# EAGLE design Switch (EAGLE 6.5.0)
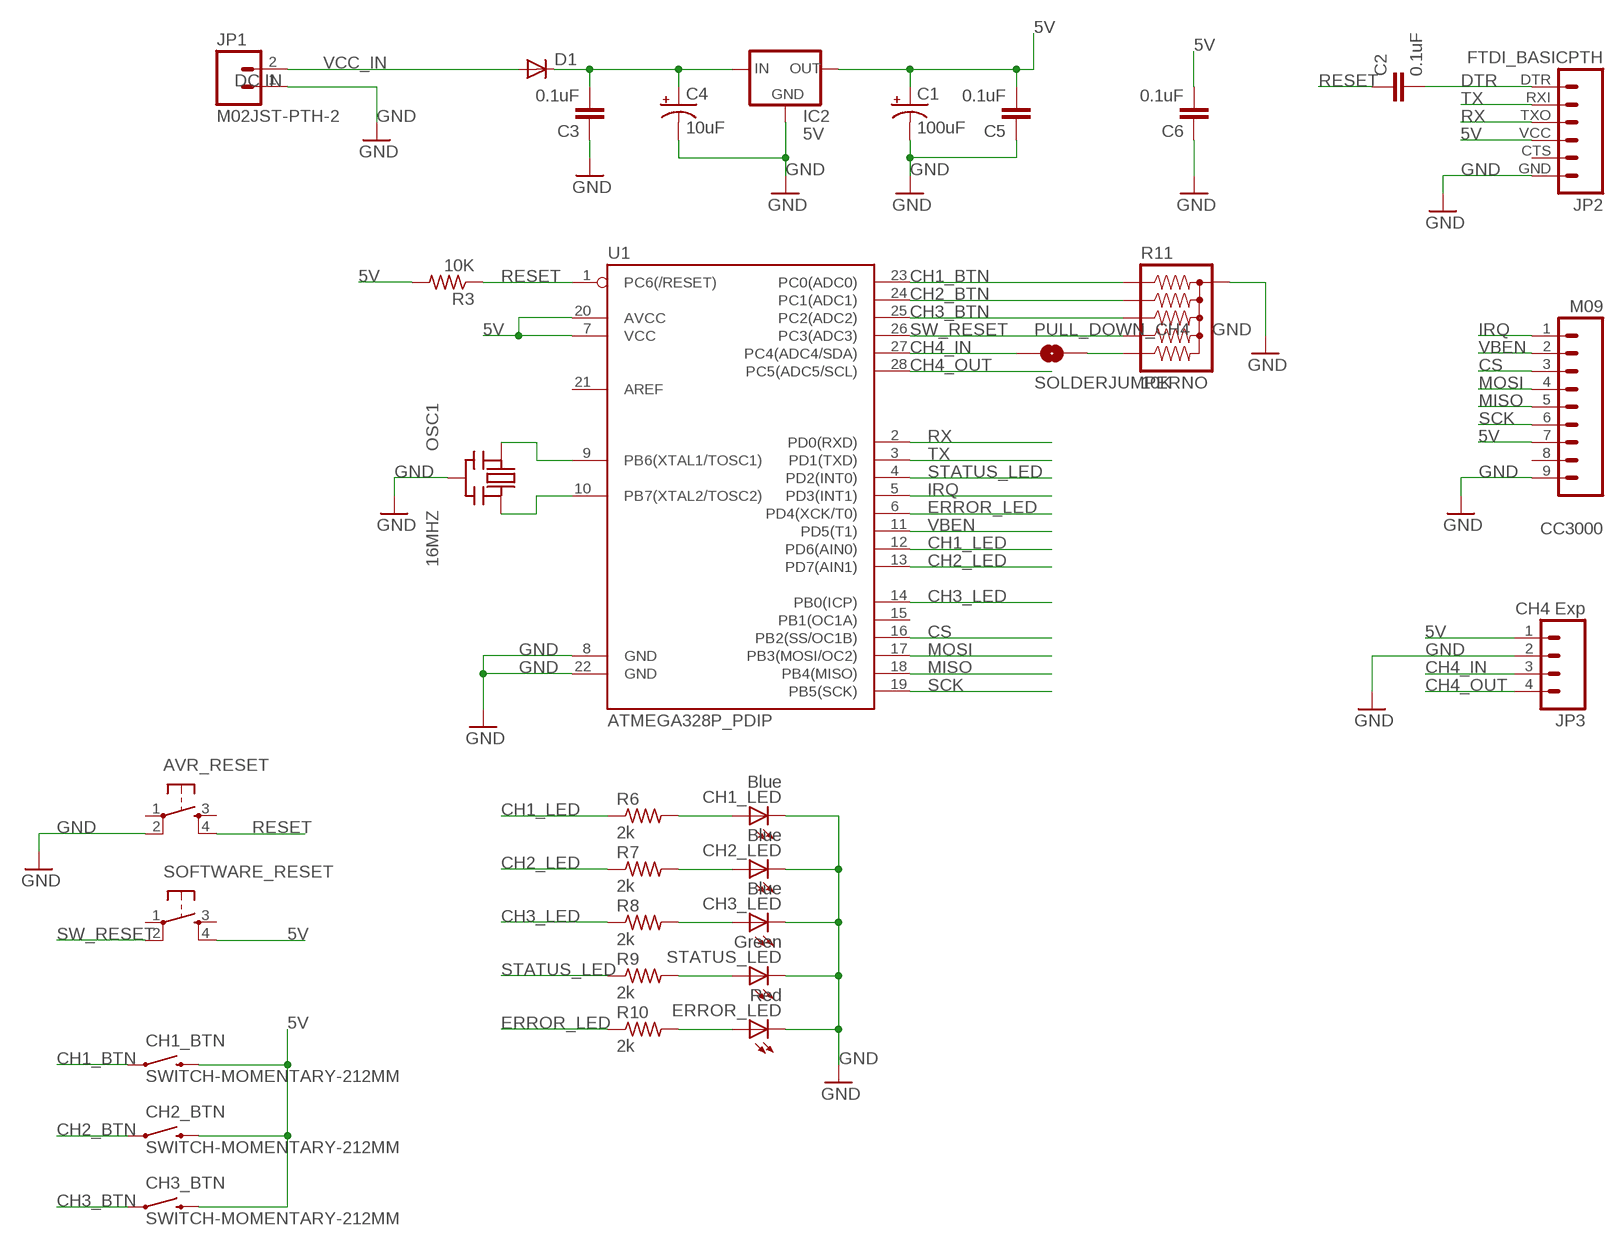
[diagram p0: schematic, sheet 1]

## Parts
AVR_RESET  TAC_SWITCHPTH  [TACTILE-PTH]
C1  100uF  CAP_POLPTH1  [CPOL-RADIAL-100UF-25V]
C2  0.1uF  CAPPTH  [CAP-PTH-SMALL]
C3  0.1uF  CAPPTH  [CAP-PTH-SMALL]
C4  10uF  CAP_POLPTH2  [CPOL-RADIAL-10UF-25V]
C5  0.1uF  CAPPTH  [CAP-PTH-SMALL]
C6  0.1uF  CAPPTH  [CAP-PTH-SMALL]
CC3000  M09  [1X09]
CH1_BTN  SWITCH-MOMENTARY-212MM  [TACTILE-PTH-12MM]
CH1_LED  Blue  LED3MM  [LED3MM]
CH2_BTN  SWITCH-MOMENTARY-212MM  [TACTILE-PTH-12MM]
CH2_LED  Blue  LED3MM  [LED3MM]
CH3_BTN  SWITCH-MOMENTARY-212MM  [TACTILE-PTH-12MM]
CH3_LED  Blue  LED3MM  [LED3MM]
D1  DIODEPTH  [DIODE-1N4001]
ERROR_LED  Red  LED3MM  [LED3MM]
IC2  5V  78XXS  [78XXS]
JP1  M02JST-PTH-2  [JST-2-PTH]
JP2  FTDI_BASICPTH  [FTDI_BASIC]
JP3  CH4 Exp  M04JST-PTH  [JST-4-PTH]
OSC1  16MHZ  CERMOSCILL-THM  [CERM_OSC]
PULL_DOWN_CH4  SOLDERJUMPERNO  [SJ_2S-NO]
R3  10K  R-US_0207/15  [0207/15]
R6  2k  R-US_0207/15  [0207/15]
R7  2k  R-US_0207/15  [0207/15]
R8  2k  R-US_0207/15  [0207/15]
R9  2k  R-US_0207/15  [0207/15]
R10  2k  R-US_0207/15  [0207/15]
R11  10K  RPACK-BUSSED-SIP-PTH-5  [RPACK-SIP-PTH-5]
SOFTWARE_RESET  TAC_SWITCHPTH  [TACTILE-PTH]
STATUS_LED  Green  LED3MM  [LED3MM]
U1  ATMEGA328P_PDIP  [DIL28-3]

## Nets
5V: C1.1(+) C5.2 C6.2 CC3000.7 CH1_BTN.3 CH2_BTN.3 CH3_BTN.3 IC2.OUT JP2.VCC JP3.1 R3.2 SOFTWARE_RESET.4 U1.7(VCC) U1.20(AVCC)
CH1_BTN: CH1_BTN.1 R11.P$2 U1.23(PC0(ADC0))
CH1_LED: R6.1 U1.12(PD6(AIN0))
CH2_BTN: CH2_BTN.1 R11.P$3 U1.24(PC1(ADC1))
CH2_LED: R7.1 U1.13(PD7(AIN1))
CH3_BTN: CH3_BTN.1 R11.P$4 U1.25(PC2(ADC2))
CH3_LED: R8.1 U1.14(PB0(ICP))
CH4_IN: JP3.3 PULL_DOWN_CH4.1 U1.27(PC4(ADC4/SDA))
CH4_OUT: JP3.4 U1.28(PC5(ADC5/SCL))
CS: CC3000.3 U1.16(PB2(SS/OC1B))
DTR: C2.2 JP2.DTR
ERROR_LED: R10.1 U1.6(PD4(XCK/T0))
GND: AVR_RESET.2 C1.2(-) C3.1 C4.2(-) C5.1 C6.1 CC3000.9 CH1_LED.K(C) CH2_LED.K(C) CH3_LED.K(C) ERROR_LED.K(C) IC2.GND JP1.1 JP2.GND JP3.2 OSC1.P$2(GND) R11.P$1 STATUS_LED.K(C) U1.8(GND) U1.22(GND)
IRQ: CC3000.1 U1.5(PD3(INT1))
MISO: CC3000.5 U1.18(PB4(MISO))
MOSI: CC3000.4 U1.17(PB3(MOSI/OC2))
N$1: ERROR_LED.A R10.2
N$2: R9.2 STATUS_LED.A
N$3: CH3_LED.A R8.2
N$4: CH2_LED.A R7.2
N$5: CH1_LED.A R6.2
N$6: OSC1.P$1(IN) U1.9(PB6(XTAL1/TOSC1))
N$7: OSC1.P$3(OUT) U1.10(PB7(XTAL2/TOSC2))
N$8: PULL_DOWN_CH4.2 R11.P$6
N$10: C3.2 C4.1(+) D1.C IC2.IN
RESET: AVR_RESET.4 C2.1 R3.1 U1.1(PC6(/RESET))
RX: JP2.TXO U1.2(PD0(RXD))
SCK: CC3000.6 U1.19(PB5(SCK))
STATUS_LED: R9.1 U1.4(PD2(INT0))
SW_RESET: R11.P$5 SOFTWARE_RESET.2 U1.26(PC3(ADC3))
TX: JP2.RXI U1.3(PD1(TXD))
VBEN: CC3000.2 U1.11(PD5(T1))
VCC_IN: D1.A JP1.2
Unconnected: AVR_RESET.1 AVR_RESET.3 CC3000.8 JP2.CTS SOFTWARE_RESET.1 SOFTWARE_RESET.3 U1.15(PB1(OC1A)) U1.21(AREF)

## Library data of the parts
AVR_RESET SOFTWARE_RESET = SparkFun-Electromechanical:TAC_SWITCH: Momentary Switch Button commonly used for reset or general input. Spark Fun Electronics SKU : COM-00097 SMT- SWCH-08247
C1 C4 = SparkFun-Passives:CAP_POL: Capacitor Polarized These are standard SMD and PTH capacitors. Normally 10uF, 47uF, and 100uF in electrolytic and tantalum varieties. Always verify the external diameter of the through hole cap, it varies with capacity, voltage, and manufacturer. The EIA devices should be standard.
C2 C3 C5 C6 = SparkFun-Passives:CAP: Capacitor Standard 0603 ceramic capacitor, and 0.1" leaded capacitor.
CC3000 = SparkFun-Connectors:M09: Header 9 Standard 9-pin 0.1" header. Use with straight break away headers (SKU : PRT-00116), right angle break away headers (PRT-00553), swiss pins (PRT-00743), machine pins (PRT-00117), and female headers (PRT-00115).
CH1_BTN CH2_BTN CH3_BTN = SparkFun-Electromechanical:SWITCH-MOMENTARY-2: Various NO switches- pushbuttons, reed, etc; PROD_ID: SWCH-09185
CH1_LED CH2_LED CH3_LED ERROR_LED STATUS_LED = SparkFun-LED:LED: LEDs Standard schematic elements and footprints for 5mm, 3mm, 1206, and 0603 sized LEDs. 5mm - Spark Fun Electronics SKU : COM-00529 (and others)
D1 = SparkFun-DiscreteSemi:DIODE: Diode These are standard reverse protection diodes and small signal diodes. SMA package can handle up to about 1A. SOD-323 can handle about 200mA. What the SOD-323 package when ordering, there are some mfgs out there that are 5-pin packages.
IC2 = v-reg:78XXS: VOLTAGE REGULATOR
JP1 = SparkFun-Connectors:M02: Standard 2-pin 0.1" header. Use with - straight break away headers ( PRT-00116) - right angle break away headers (PRT-00553) - swiss pins (PRT-00743) - machine pins (PRT-00117) - female headers (PRT-00115) Molex polarized connector foot print use with: PRT-08233 with associated crimp pins and housings. 2.54_SCREWTERM for use with PRT-10571. 3.5mm Screw Terminal footprints for PRT-08084 5mm Screw Terminal footprints for use with PRT-08433; LABEL: DC IN; SKU: PRT-09914
JP2 = SparkFun-Connectors:FTDI_BASIC: FTDI Basic header with labels
JP3 = SparkFun-Connectors:M04: Header 4 Standard 4-pin 0.1" header. Use with straight break away headers (SKU : PRT-00116), right angle break away headers (PRT-00553), swiss pins (PRT-00743), machine pins (PRT-00117), and female headers (PRT-00115). Molex polarized connector foot print use with SKU : PRT-08231 with associated crimp pins and housings. 1MM SMD Version SKU: PRT-10208; SKU: PRT-09916
OSC1 = adafruit:CERMOSCILL: Ceramic oscillator with built in capacitors such as ZTT-12MHz http://www.ladyada.net/library/eagle
PULL_DOWN_CH4 = SparkFun-Passives:SOLDERJUMPER: Solder Jumper Standard SMD solder jumper. Used to automate production. Two varients : Normally Open and Normally Closed are the same, but have different paste layers. NC will have a large amount of paste and should jumper during reflow.
R3 R6-R10 = resistor:R-US_: RESISTOR, American symbol
R11 = SparkFun-Passives:RPACK*: BOURNS 4600X series thick-film SIP resistor packs Five resistors bussed to a single pin (denoted by dot). 0.2W / resistor datasheet <http://dlnmh9ip6v2uc.cloudfront.net/datasheets/Components/General/4600x.pdf> SFE parts COM-10855 (330), COM-10856 (10K)
U1 = SparkFun-DigitalIC:ATMEGA328P_PDIP: uC used in the Arduino 32kb flash, 1k EEPROM, 2k SRAM This is the through-hole version of this chip.

## Board
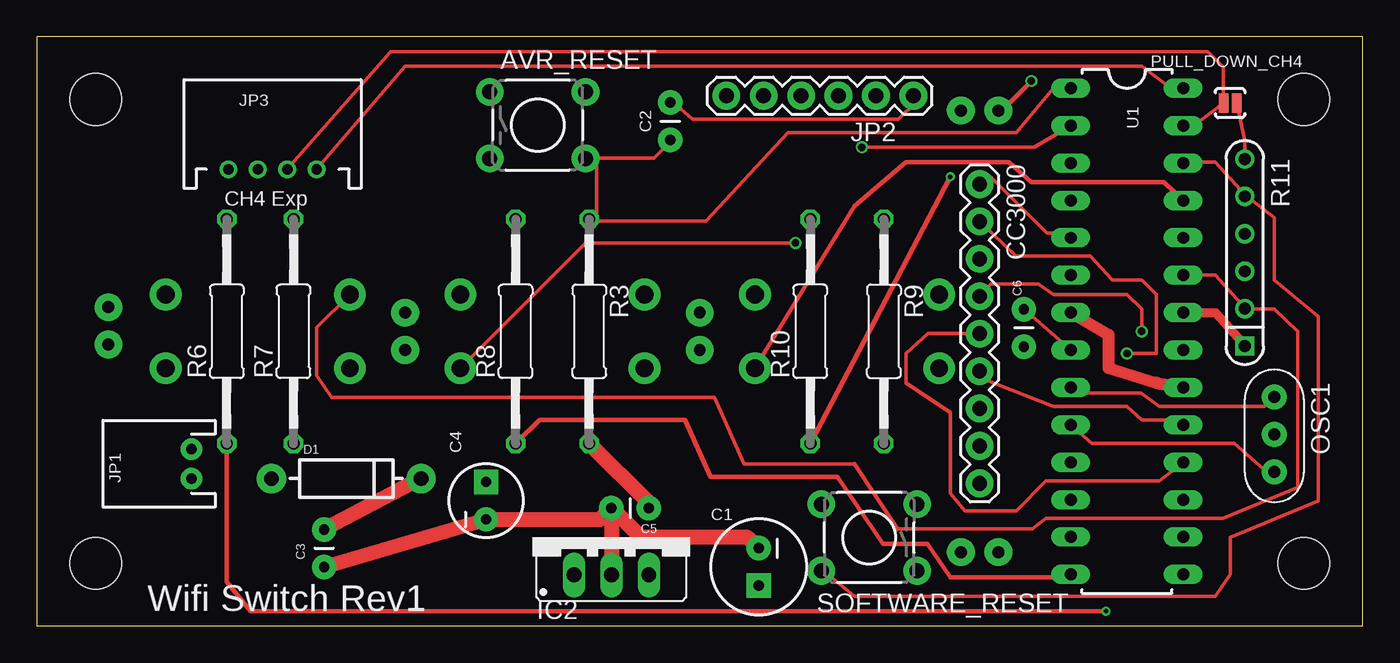
[diagram p1: board, top side]
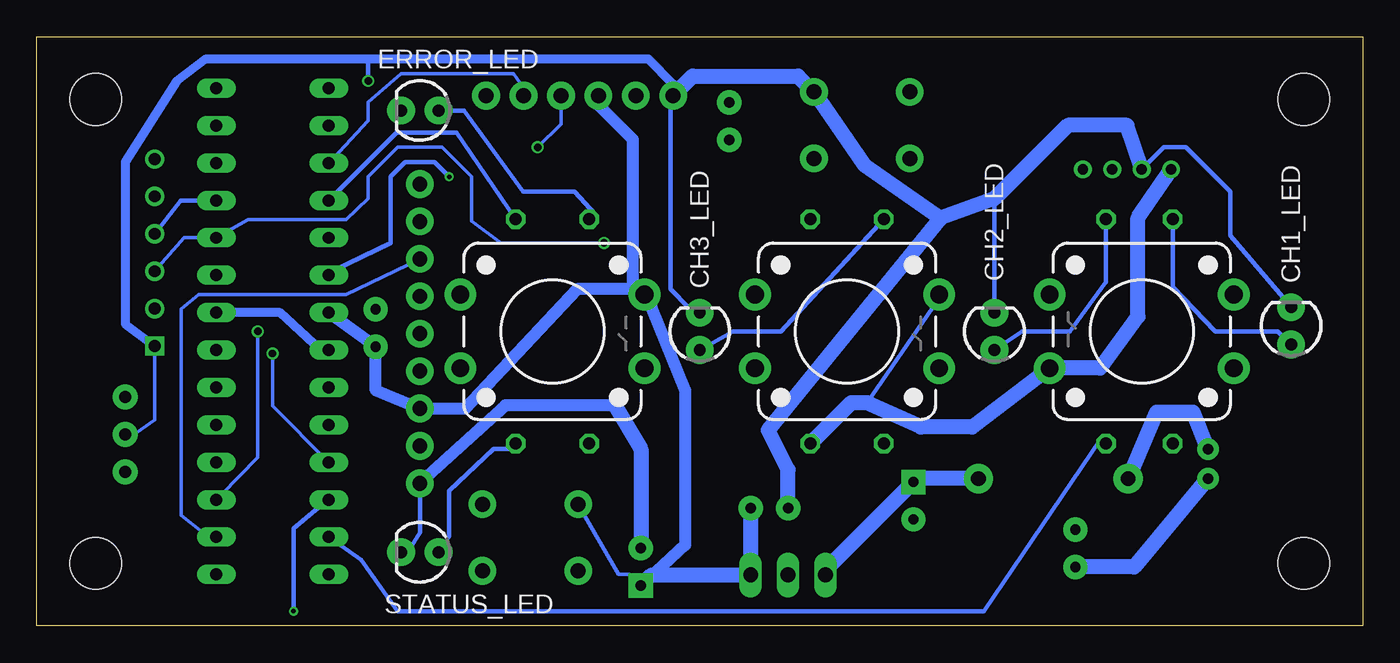
[diagram p2: board, bottom side, seen from below]

Size 90 x 40 mm. Coordinates in mm from the lower left corner, seen from the top.
Outline: 0,0 90,0 90,40 0,40 0,0
Copper layers (1*16): Top 0.035mm / dielectric 1.5mm / Bottom 0.035mm
Design rules "SeeedStudio_2layer_DRU_no_angle_20140221": minimum track width 6mil, minimum drill 12mil, track to track 6mil, track to pad 6mil, pad to pad 6mil, via to via 6mil, smd to smd 0mil, copper to edge 10mil, drill to drill 10mil, minimum pad ring 10mil, minimum via ring 6mil, stop-mask expansion 2mil, vias tented up to drill 100mil, thermal gap 10mil
Holes 3.5 mm at 4,4.25 4,35.75 86,35.75 86,4.25

### Footprints (pad centres in the part's own frame; a part is rotated, then mirrored left to right if it is on the bottom)
TACTILE-PTH = drill 1.016 pad 1.88: 1 -3.251,2.261; 2 3.251,2.261; 3 -3.251,-2.261; 4 3.251,-2.261
CPOL-RADIAL-100UF-25V = drill 0.7 pad 1.651 square: 1 1.27,0 | drill 0.7 pad 1.651: 2 -1.27,0
CAP-PTH-SMALL = drill 0.7 pad 1.651: 1 0,0; 2 2.54,0
CPOL-RADIAL-10UF-25V = drill 0.7 pad 1.651 square: 1 1.27,0 | drill 0.7 pad 1.651: 2 -1.27,0
1X09 = drill 1.016 pad 1.88: 1 0,0; 2 2.54,0; 3 5.08,0; 4 7.62,0; 5 10.16,0; 6 12.7,0; 7 15.24,0; 8 17.78,0; 9 20.32,0
TACTILE-PTH-12MM = drill 1.2 pad 2.159: 1 6.25,-2.5; 2 -6.25,-2.5; 3 6.25,2.5; 4 -6.25,2.5
LED3MM = drill 0.813 pad 1.88: A -1.27,0; K 1.27,0
DIODE-1N4001 = drill 1 pad 1.981: A -5.08,0; C 5.08,0
78XXS = drill 1.016 long: GND 0,-2.54; IN -2.54,-2.54; OUT 2.54,-2.54
JST-2-PTH = drill 0.7 pad 1.448: 1 -1,0; 2 1,0
FTDI_BASIC = drill 1.016 pad 1.88: CTS 10.16,0; DTR 0,0; GND 12.7,0; RXI 2.54,0; TXO 5.08,0; VCC 7.62,0
JST-4-PTH = drill 0.7: 1 -3,-5; 2 -1,-5; 3 1,-5; 4 3,-5
CERM_OSC = drill 0.813 pad 1.676: P$1 -2.54,0; P$2 0,0; P$3 2.54,0
SJ_2S-NO = smd 0.635 x 1.27: 1 -0.45,0; 2 0.45,0
0207/15 = drill 0.813 octagon: 1 -7.62,0; 2 7.62,0
RPACK-SIP-PTH-5 = drill 0.8 square: P$1 0,0 | drill 0.8: P$2 0,-2.54; P$3 0,-5.08; P$4 0,-7.62; P$5 0,-10.16; P$6 0,-12.7
DIL28-3 = drill 0.813 long: 1 -16.51,-3.81; 2 -13.97,-3.81; 3 -11.43,-3.81; 4 -8.89,-3.81; 5 -6.35,-3.81; 6 -3.81,-3.81; 7 -1.27,-3.81; 8 1.27,-3.81; 9 3.81,-3.81; 10 6.35,-3.81; 11 8.89,-3.81; 12 11.43,-3.81; 13 13.97,-3.81; 14 16.51,-3.81; 15 16.51,3.81; 16 13.97,3.81; 17 11.43,3.81; 18 8.89,3.81; 19 6.35,3.81; 20 3.81,3.81; 21 1.27,3.81; 22 -1.27,3.81; 23 -3.81,3.81; 24 -6.35,3.81; 25 -8.89,3.81; 26 -11.43,3.81; 27 -13.97,3.81; 28 -16.51,3.81

### Placement (x,y rotation side)
AVR_RESET  34,34 0 top
C1  49,4 270 top
C2  43,33 90 top
C3  19.5,4 90 top
C4  30.5,8.5 90 top
C5  39,8 0 top
C6  67,21.5 270 top
CC3000  64,30 270 top
CH1_BTN  15,20 180 bottom
CH1_LED  4.86,20.37 90 bottom
CH2_BTN  35,20 0 bottom
CH2_LED  25,20 90 bottom
CH3_BTN  55,20 0 bottom
CH3_LED  45,20 90 bottom
D1  21,10 0 top
ERROR_LED  64,35 180 bottom
IC2  39,6 0 top
JP1  10.5,11 90 top
JP2  59.5,36 180 top
JP3  16,36 0 top
OSC1  84,13 270 top
PULL_DOWN_CH4  81,35.5 0 top
R3  37.5,20 270 top
R6  12.9,20 90 top
R7  17.42,20 90 top
R8  32.5,20 90 top
R9  57.5,20 270 top
R10  52.5,20 90 top
R11  82,19 180 top
SOFTWARE_RESET  56.5,6 180 top
STATUS_LED  64,5 180 bottom
U1  74,20 270 top

### Tracks (layer width: path | path; a pad name or v marks a point on that pad's centre or on a via)
5V
  Top 0.813: U1.7 72.75,19.77 72.75,17.5 76,16.5 U1.20
  Top 1.016: R3.2 41.54,8.34 C5.2
  Bottom 0.254: C1.1 49.77,3.5 50.5,3.5 SOFTWARE_RESET.4
  Bottom 0.305: 33.65,15.15 29.21,21.59 CH2_BTN.3
  Bottom 0.813: 49.53,22.86 49.53,33.02 52.07,35.56 JP2.VCC | 64,14.74 60.96,14.74 53.34,22.86 49.53,22.86 | 64,14.74 CC3000.7 | 49.53,22.86 CH3_BTN.3 48.26,21.59 46,16 46,5.5 C1.1 | 64,14.74 67,16 C6.2 U1.7
  Bottom 1.016: R3.2 34.73,15.15 33.65,15.15 30,13.5 26.5,13.5 CH1_BTN.3 17.82,17.5 15.25,21 15.25,27.71 JP3.1 | C5.2 IC2.OUT 48.27,3.46 C1.1
CH1_BTN
  Top 0.254: 82.05,21.5 80.01,23.81 U1.23 | 58.42,6.6 67.58,6.6 68.5,7.3 80.5,7.3 85.59,9.39 85.59,20 84,21.5 82.05,21.5 | 82.05,21.5 R11.P$2 | CH1_BTN.1 19,20.25 19,17 20,15.5 46,15.5 48,11 55.5,11
  Top 0.305: 55.5,11 58.42,6.6
CH1_LED  (via drill 0.3)
  Top 0.305: v72.58,1 14.5,1 12.9,3 R6.1
  Bottom 0.305: v72.58,1 72.58,6.62 69.85,8.89 U1.12
CH2_BTN  (via drill 0.5)
  Top 0.254: CH2_BTN.1 37.25,26 v51.5,26
  Bottom 0.254: v51.5,26 58.5,26 60.5,27.5 60.5,30.5 62.5,32.5 65.5,32.5 67.5,30.5 67.5,29 69,27.6 75.66,27.6 U1.24 80.01,26.35 R11.P$3
CH2_LED
  Bottom 0.305: R7.1 17.78,12.7 25.71,1 65.5,1 68,4.5 U1.13
CH3_BTN
  Top 0.305: U1.25 76.5,30.15 67.5,30.15 66,31.5 59,31.5 55.5,28.5 CH3_BTN.1
  Bottom 0.305: R11.P$4 80.23,28.89 U1.25
CH3_LED
  Top 0.305: U1.14 69.85,3.31 62,3.31 60.46,5.58 57.42,5.58 54.34,10.1 45.72,10.1 44,14 34.12,14 R8.1
CH4_IN
  Top 0.254: JP3.3 24,39 79.5,39 80.55,37.95 PULL_DOWN_CH4.1 78.55,33.97 U1.27
CH4_OUT
  Top 0.254: JP3.4 25,38 75,38 76.99,36.51 U1.28
CS
  Bottom 0.254: U1.16 78.74,6.35 80.2,7.5 80.2,21.5 79,22.5 69,22.5 CC3000.3
DTR
  Top 0.254: C2.2 43.18,35.56 44.5,34.4 58.5,34.4 59.69,35.56 JP2.DTR
ERROR_LED  (via drill 0.3)
  Top 0.305: R10.1 v62,30.5
  Bottom 0.305: v62,30.5 63,31.5 65,31.5 66,30.5 66,26 69.85,24.13 U1.6
GND  (via drill 0.5)
  Top 0.254: C6.1 U1.8
  Top 0.305: ERROR_LED.K 65.5,35 v67.5,37
  Top 0.61: U1.22 80.01,21.27 81.55,19.55 R11.P$1
  Top 1.016: C3.1 C4.2 38.23,7.23 C5.1 | C5.1 IC2.GND | C1.2 48.27,6 41,6 C5.1
  Bottom 0.152: 82,19.05 R11.P$1
  Bottom 0.254: 82,19.05 82,13.97 83.82,12.7 OSC1.P$2
  Bottom 0.305: CH3_LED.K 45.72,21.59 46.99,22.86 46.99,35.56 JP2.GND | CH1_LED.K 9,26.5 9,29.5 12,32.5 13.5,32.5 JP3.2 | CC3000.9 64,6.35 64.77,5.08 STATUS_LED.K | CH2_LED.K 25,29 | v67.5,37 67.5,38.5
  Bottom 0.61: JP2.GND 46.8,36.8 48.5,38.5 67.5,38.5 78.5,38.5 80.5,37 84,31.5 84,20.5 R11.P$1 | U1.8 70.73,18.73 73.5,21.27 U1.22
  Bottom 0.813: 50.76,14.97 58.19,14.97 63.5,10.16 CC3000.9
  Bottom 1.016: JP2.GND 45.49,37.33 38.33,37.33 AVR_RESET.2 33.83,31.29 28.68,27.69 | 50.76,14.97 49,12.01 C1.2 | 28.68,27.69 25,29 20,34 16,34 JP3.2 | 28.68,27.69 40.36,13.29 39,10.62 C5.1 | JP1.1 15.5,4 C3.1
IRQ
  Top 0.254: U1.5 69.85,26.67 68.58,26.67 64.77,30.48 CC3000.1
MISO
  Top 0.254: CC3000.5 60.5,19.84 59,18.5 59,16.5 62,14.5 62,9 63,7.8 66.5,7.8 68.5,9.85 76.2,9.85 U1.18
MOSI  (via drill 0.5)
  Top 0.254: v75,20 75,21.5 74,22.5 69,22.5 68,23.2 64.77,23.2 CC3000.4
  Bottom 0.254: v75,20 75,11.43 77.47,8.89 U1.17
N$1
  Bottom 0.305: R10.2 52.07,27.94 53.5,29.5 57,29.5 61,35 ERROR_LED.A
N$2
  Bottom 0.305: R9.2 58,12 59,12 62,9.16 62,6.08 STATUS_LED.A
N$3
  Bottom 0.305: R8.2 39.5,20 42.73,20 CH3_LED.A
N$4
  Bottom 0.305: R7.2 17.42,23.36 19.86,20 23.13,20 CH2_LED.A
N$5
  Bottom 0.305: R6.2 12.9,23 10,20 5.76,20 CH1_LED.A
N$6
  Top 0.254: U1.9 71.12,15.8 74.93,15.8 76.2,14.9 83.32,14.9 OSC1.P$1
N$7
  Top 0.254: U1.10 71.62,12.4 81.28,12.4 83.82,10.16 OSC1.P$3
N$8
  Top 0.254: PULL_DOWN_CH4.2 82,32.95 R11.P$6
N$10
  Top 1.016: D1.C C3.2
  Bottom 1.016: D1.C 30.27,10 C4.1 36.46,3.81 IC2.IN
RESET
  Top 0.254: 38,31.75 38,27.5 | 38,27.5 45.44,27.5 51,33.5 66.5,33.5 69.01,36.51 U1.1 | 38,27.5 R3.1 | 38,31.75 41.91,31.75 43.18,33.02 C2.1 | 38,31.75 AVR_RESET.4
RX  (via drill 0.5)
  Top 0.254: v56,32.5 67.72,32.5 U1.2
  Bottom 0.254: JP2.TXO 54.42,34.08 v56,32.5
SCK
  Top 0.254: U1.19 77.5,14 75,14 74,14.9 69,14.9 64.27,16.78 CC3000.6
STATUS_LED
  Bottom 0.305: R9.1 61.5,33.5 65.58,33.5 U1.4
SW_RESET
  Top 0.152: 82.05,29.21 R11.P$5
  Top 0.254: U1.26 78.74,31.5 80.01,31.5 82.05,29.21 84,27.71 84,23.5 87,21 87,8.5 81,6 81,3.5 80,2 55.5,2 53.34,3.81 SOFTWARE_RESET.2
TX
  Bottom 0.254: U1.3 69.85,31.75 67.5,34.29 67.5,35.56 65.27,37.5 57.65,37.5 57.15,36.83 JP2.RXI
VBEN  (via drill 0.5)
  Top 0.254: v74,18.5 76,18.5 76,22.5 75,23.5 73,23.5 71.5,25.1 66.46,25.1 CC3000.2
  Bottom 0.254: U1.11 74,14.92 v74,18.5
VCC_IN
  Bottom 1.016: JP1.2 11.5,14.5 14,14.5 D1.A

### Text on the board
tNames: Wifi Switch Rev1